# EAGLE schematic base2 (EAGLE 6.5.0)
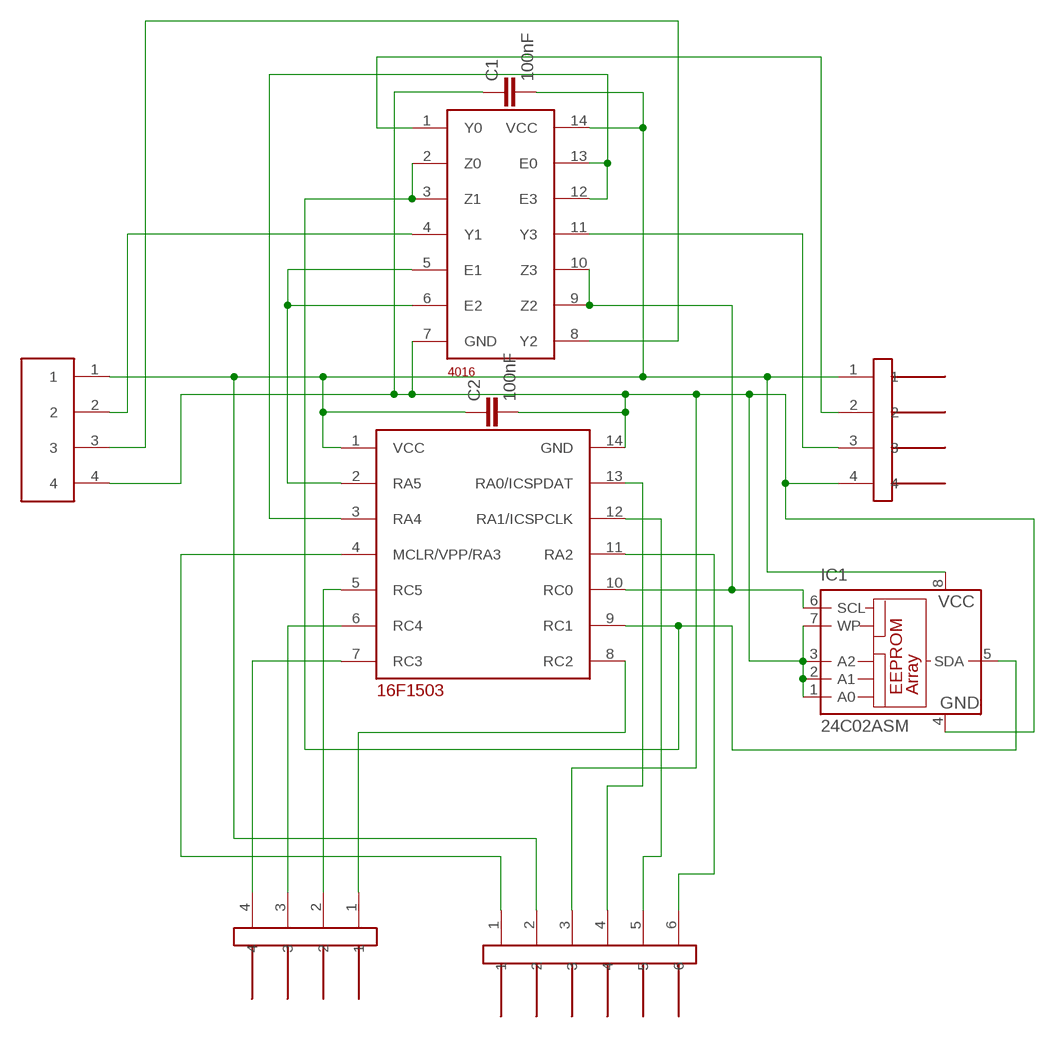
[diagram p0: schematic, sheet 1]

## Parts
C1  100nF  C-EUC0805  [C0805]
C2  100nF  C-EUC0805  [C0805]
IC1  24C02ASM  [SO-08M]
INPUT  JUMPER4  [JUMPER4]
IO  JUMPER4M  [JUMPER4M]
OUTPUT  JUMPER4F  [JUMPER4F]
PROGRAMMER  JUMPER6M  [JUMPER6M]
U$1  16F1503  [16F1503]
U$2  4016  [SO14]

## Nets
GND: C1.1 C2.2 IC1.1(A0) IC1.2(A1) IC1.3(A2) IC1.4(GND) IC1.7(WP) INPUT.4 OUTPUT.4 PROGRAMMER.3 U$1.14(GND) U$2.7(GND)
N$3: OUTPUT.2 U$2.4(Y1)
N$4: IC1.6(SCL) U$1.10(RC0) U$2.9(Z2) U$2.10(Z3)
N$5: U$1.2(RA5) U$2.5(E1) U$2.6(E2)
N$6: U$1.3(RA4) U$2.12(E3) U$2.13(E0)
N$7: IC1.5(SDA) U$1.9(RC1) U$2.2(Z0) U$2.3(Z1)
N$8: INPUT.2 U$2.1(Y0)
N$9: OUTPUT.3 U$2.8(Y2)
N$10: INPUT.3 U$2.11(Y3)
N$11: PROGRAMMER.6 U$1.11(RA2)
N$12: IO.2 U$1.5(RC5)
N$13: PROGRAMMER.1 U$1.4(MCLR/VPP/RA3)
N$14: PROGRAMMER.4 U$1.13(RA0/ICSPDAT)
N$15: PROGRAMMER.5 U$1.12(RA1/ICSPCLK)
N$16: IO.4 U$1.7(RC3)
N$17: IO.3 U$1.6(RC4)
N$18: IO.1 U$1.8(RC2)
VCC: C1.2 C2.1 IC1.8(VCC) INPUT.1 OUTPUT.1 PROGRAMMER.2 U$1.1(VCC) U$2.14(VCC)

## Library data of the parts
C1 C2 = rcl:C-EU: CAPACITOR, European symbol
IC1 = microchip:24*: Serial EEPROM I2C; MF: MICROCHIP; MPN: 24C02C/SN; OC_FARNELL: 1084339; OC_NEWARK: 96K4065
INPUT = !stavebnice03:JUMPER4
IO = !stavebnice03:JUMPER4M
OUTPUT = !stavebnice03:JUMPER4F
PROGRAMMER = !stavebnice03:JUMPER6M
U$1 = !stavebnice03:16F1503
U$2 = !stavebnice03:4016